# Altium schematic sheet SENSORS.SchDoc
size 393 x 261 mm; SheetNumber: 5; SheetTotal: 6
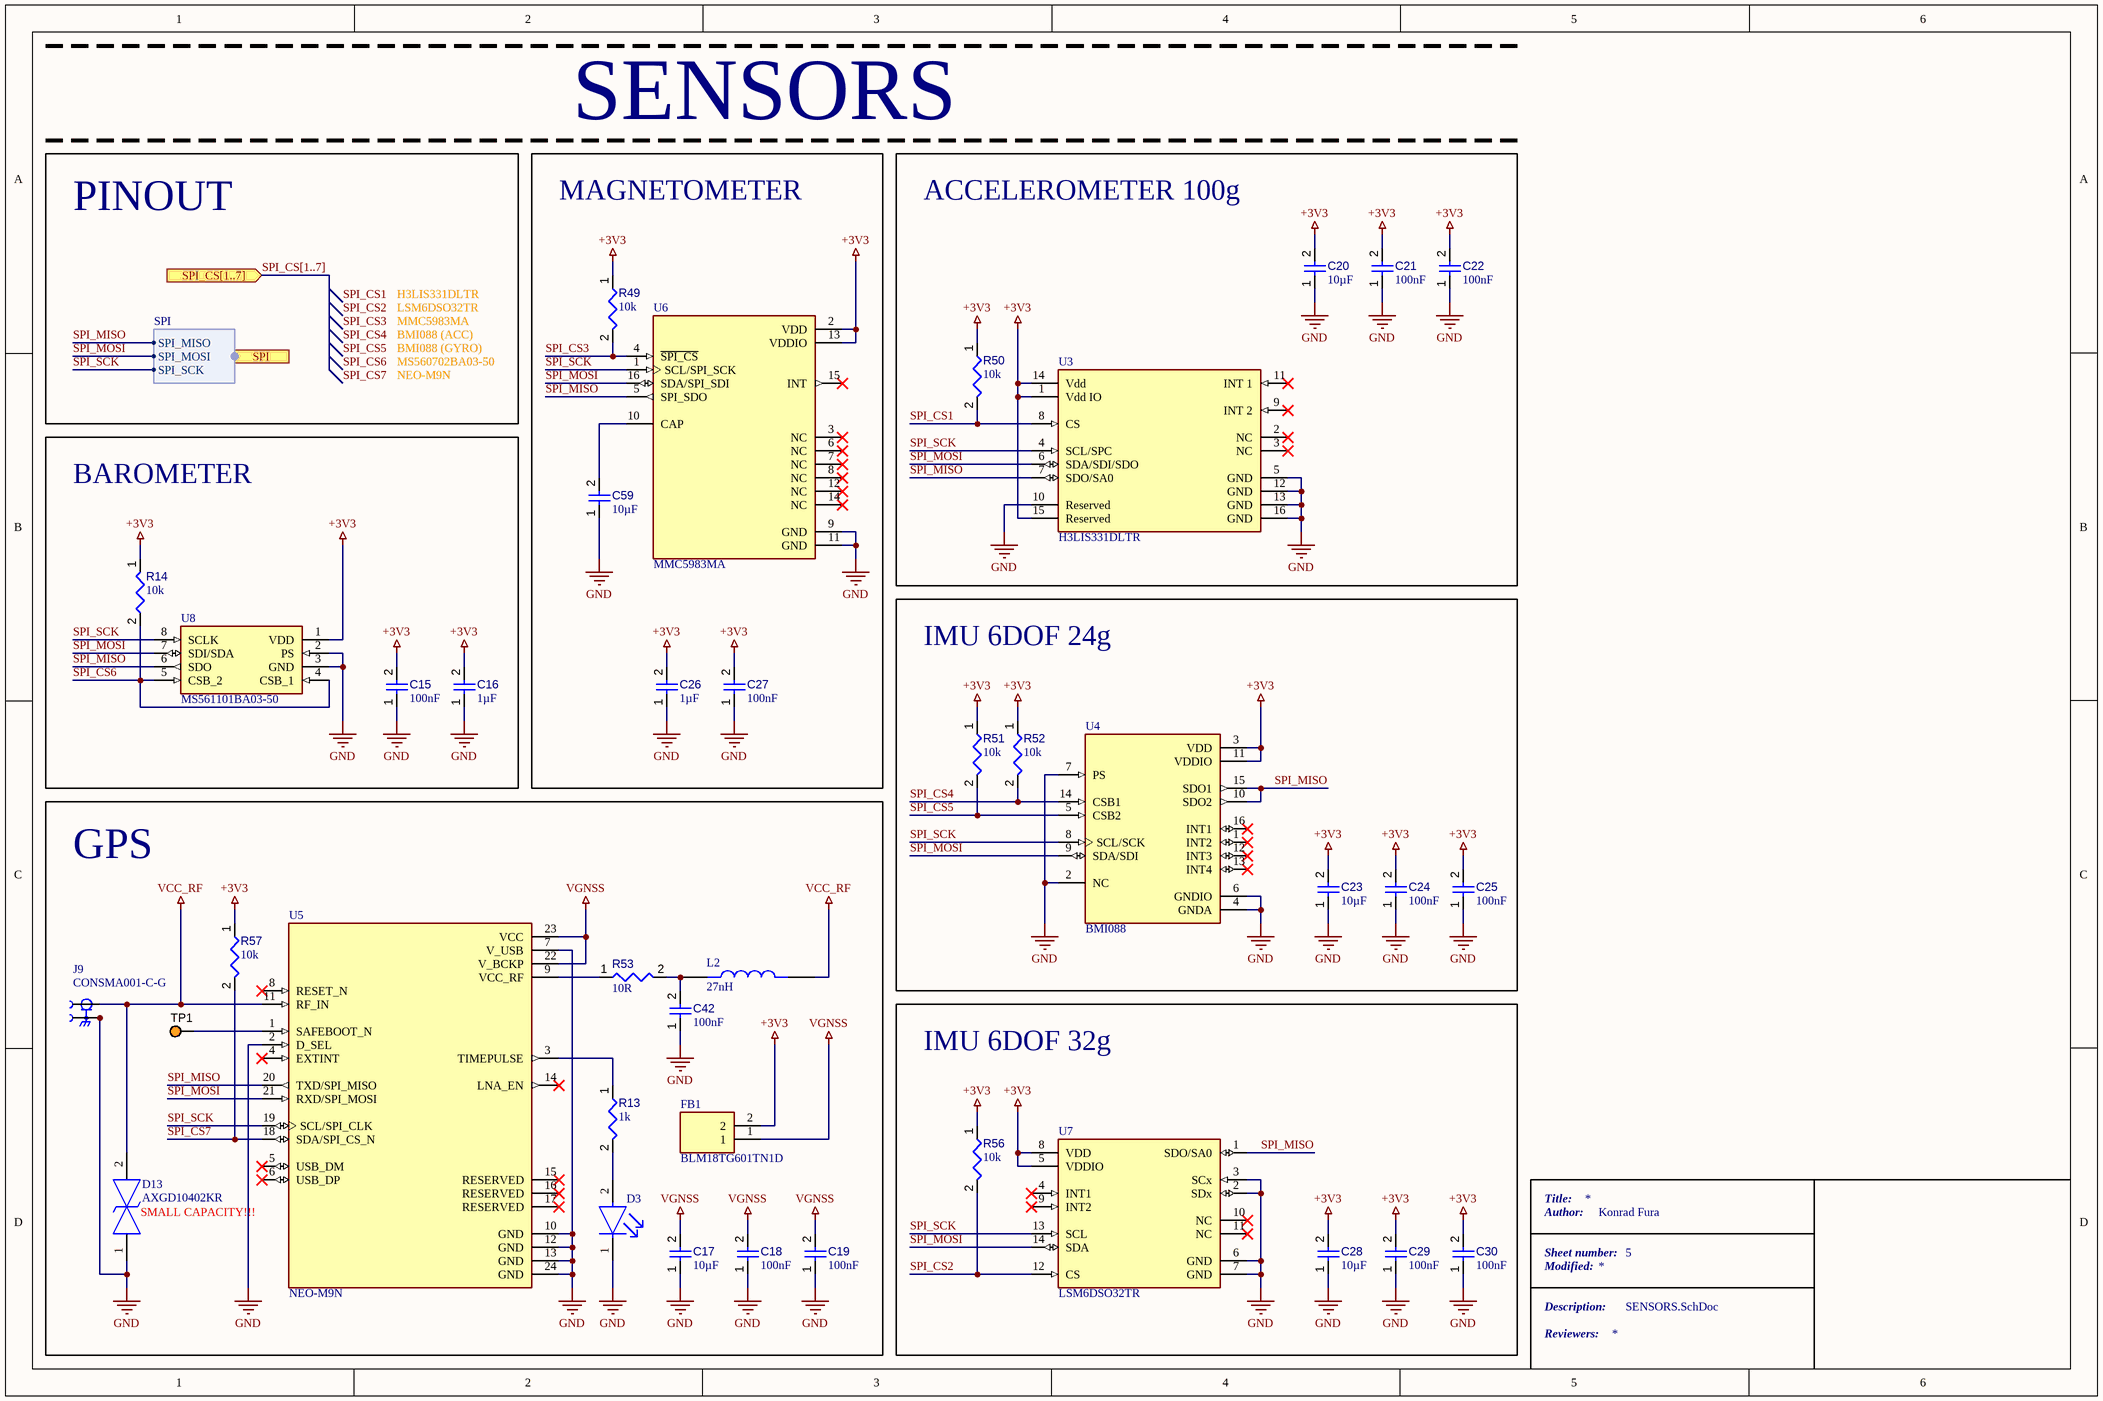
[diagram p0: SENSORS.SchDoc]

## Parts
C15  value 100nF  [CAPC0402(1005)60_L]  (hidden comment: Capacitor 100nF +/-20% 10V 0402)
C16  value 1µF  [CAPC0402(1005)60_L]  (hidden comment: Capacitor 1µF +/-20% 10V 0402)
C17  value 10µF  [CAPC0603(1608)100_L]  (hidden comment: Capacitor 10µF +/-20% 10V 0603)
C18  value 100nF  [CAPC0402(1005)60_L]  (hidden comment: Capacitor 100nF +/-20% 10V 0402)
C19  value 100nF  [CAPC0402(1005)60_L]  (hidden comment: Capacitor 100nF +/-20% 10V 0402)
C20  value 10µF  [CAPC0603(1608)100_L]  (hidden comment: Capacitor 10µF +/-20% 10V 0603)
C21  value 100nF  [CAPC0402(1005)60_L]  (hidden comment: Capacitor 100nF +/-20% 10V 0402)
C22  value 100nF  [CAPC0402(1005)60_L]  (hidden comment: Capacitor 100nF +/-20% 10V 0402)
C23  value 10µF  [CAPC0603(1608)100_L]  (hidden comment: Capacitor 10µF +/-20% 10V 0603)
C24  value 100nF  [CAPC0402(1005)60_L]  (hidden comment: Capacitor 100nF +/-20% 10V 0402)
C25  value 100nF  [CAPC0402(1005)60_L]  (hidden comment: Capacitor 100nF +/-20% 10V 0402)
C26  value 1µF  [CAPC0402(1005)60_L]  (hidden comment: Capacitor 1µF +/-20% 10V 0402)
C27  value 100nF  [CAPC0402(1005)60_L]  (hidden comment: Capacitor 100nF +/-20% 10V 0402)
C28  value 10µF  [CAPC0603(1608)100_L]  (hidden comment: Capacitor 10µF +/-20% 10V 0603)
C29  value 100nF  [CAPC0402(1005)60_L]  (hidden comment: Capacitor 100nF +/-20% 10V 0402)
C30  value 100nF  [CAPC0402(1005)60_L]  (hidden comment: Capacitor 100nF +/-20% 10V 0402)
C42  value 100nF  [CAPC0402(1005)60_L]  (hidden comment: Capacitor 100nF +/-20% 10V 0402)
C59  value 10µF  [CAPC0603(1608)100_L]  (hidden comment: Capacitor 10µF +/-20% 10V 0603)
D3  D3  [FP-LTST-C191TBKT-MFG]  (value not drawn)
D13  AXGD10402KR  [DIONM105X51N]
FB1  BLM18TG601TN1D  [BLM18EG101TH1D]
J9  CONSMA001-C-G  [LINX_CONSMA001-C-G]
L2  27nH  [INDC1005X65N]
R13  value 1k  [RESC0402(1005)_L]  (hidden comment: Resistor 1K +/-5 % 0402 63 mW)
R14  value 10k  [RESC0402(1005)_L]  (hidden comment: Resistor 10K  +/-1 % 0402 63 mW)
R49  value 10k  [RESC0402(1005)_L]  (hidden comment: Resistor 10K  +/-1 % 0402 63 mW)
R50  value 10k  [RESC0402(1005)_L]  (hidden comment: Resistor 10K  +/-1 % 0402 63 mW)
R51  value 10k  [RESC0402(1005)_L]  (hidden comment: Resistor 10K  +/-1 % 0402 63 mW)
R52  value 10k  [RESC0402(1005)_L]  (hidden comment: Resistor 10K  +/-1 % 0402 63 mW)
R53  value 10R  [RESC0402(1005)_L]  (hidden comment: Resistor 10R  +/-1 % 0402 63 mW)
R56  value 10k  [RESC0402(1005)_L]  (hidden comment: Resistor 10K  +/-1 % 0402 63 mW)
R57  value 10k  [RESC0402(1005)_L]  (hidden comment: Resistor 10K  +/-1 % 0402 63 mW)
TP1  5003  [KSTN-5003]  (value not drawn)
U3  H3LIS331DLTR  [FP-TFLGA16-7983231-MFG]
U4  BMI088  [PQFN50P450X300X100-16N]
U5  NEO-M9N  [XCVR_NEO-M9N]
U6  MMC5983MA  [PQFN50P300X300X100-16N]
U7  LSM6DSO32TR  [FP-LGA-14L-DM00249496-MFG]
U8  MS561101BA03-50  [MS561101BA03-50]

## Blocks framed on the sheet
SENSORS: C26 C27 C59 R49 U6
ACCELEROMETER 100g: C20-C22 R50 U3
BAROMETER: C15 C16 R14 U8
IMU 6DOF 24g: C23-C25 R51 R52 U4
GPS: C17-C19 C42 D3 D13 FB1 J9 L2 R13 R53 R57 TP1 U5
IMU 6DOF 32g: C28-C30 R56 U7

## Ports
SPI (harness SPI, see SYSTEM_OVERVIEW[4C], MCU[3A]), SPI_CS[1..7] (in, see SYSTEM_OVERVIEW[4C], MCU[6A])

## Harnesses
SPI: SPI_MISO, SPI_MOSI, SPI_SCK

## Nets
+3V3: C15.2 C16.2 C20.2 C21.2 C22.2 C23.2 C24.2 C25.2 C26.2 C27.2 C28.2 C29.2 C30.2 FB1.2 R14.1 R49.1 R50.1 R51.1 R52.1 R56.1 R57.1 U3.1(Vdd_IO) U3.14(Vdd) U3.15(Reserved) U4.3(VDD) U4.11(VDDIO) U6.2(VDD) U6.13(VDDIO) U7.5(VDDIO) U7.8(VDD) U8.1(VDD)
GND: C15.1 C16.1 C17.1 C18.1 C19.1 C20.1 C21.1 C22.1 C23.1 C24.1 C25.1 C26.1 C27.1 C28.1 C29.1 C30.1 C42.1 C59.1 D3.1(C) D13.1 J9.S1 J9.S2 J9.S3 J9.S4 U3.5(GND) U3.10(Reserved) U3.12(GND) U3.13(GND) U3.16(GND) U4.2(NC) U4.4(GNDA) U4.6(GNDIO) U4.7(PS) U5.2(D_SEL) U5.7(V_USB) U5.10(GND) U5.12(GND) U5.13(GND) U5.24(GND) U6.9(GND) U6.11(GND) U7.2(SDx) U7.3(SCx) U7.6(GND) U7.7(GND) U8.2(PS) U8.3(GND)
VCC_RF: D13.2 J9.1 L2.2 U5.11(RF_IN)
VGNSS: C17.2 C18.2 C19.2 FB1.1 U5.22(V_BCKP) U5.23(VCC)
SPI_CS1: R50.2 U3.8(CS)
SPI_CS2: R56.2 U7.12(CS)
SPI_CS3: R49.2 U6.4(~{SPI_CS})
SPI_CS4: R52.2 U4.14(CSB1)
SPI_CS5: R51.2 U4.5(CSB2)
SPI_CS6: R14.2 U8.4(CSB_1) U8.5(CSB_2)
SPI_CS7: R57.2 U5.18(SDA/SPI_CS_N)
SPI_MISO: U3.7(SDO/SA0) U4.10(SDO2) U4.15(SDO1) U5.20(TXD/SPI_MISO) U6.5(SPI_SDO) U7.1(SDO/SA0) U8.6(SDO) ; port SPI.SPI_MISO
SPI_MOSI: U3.6(SDA/SDI/SDO) U4.9(SDA/SDI) U5.21(RXD/SPI_MOSI) U6.16(SDA/SPI_SDI) U7.14(SDA) U8.7(SDI/SDA) ; port SPI.SPI_MOSI
SPI_SCK: U3.4(SCL/SPC) U4.8(SCL/SCK) U5.19(SCL/SPI_CLK) U6.1(SCL/SPI_SCK) U7.13(SCL) U8.8(SCLK) ; port SPI.SPI_SCK
NetC42_2: C42.2 L2.1 R53.2
NetC59_2: C59.2 U6.10(CAP)
NetD3_2: D3.2(A) R13.2
NetR13_1: R13.1 U5.3(TIMEPULSE)
NetR53_1: R53.1 U5.9(VCC_RF)
NetTP1_1: TP1.1 U5.1(SAFEBOOT_N)

Not connected (* = marked no-connect by the designer): U3 2(NC)* 3(NC)* 9(INT_2)* 11(INT_1)*; U4 1(INT2)* 12(INT3)* 13(INT4)* 16(INT1)*; U5 4(EXTINT)* 5(USB_DM)* 6(USB_DP)* 8(RESET_N)* 14(LNA_EN)* 15(RESERVED)* 16(RESERVED)* 17(RESERVED)*; U6 3(NC)* 6(NC)* 7(NC)* 8(NC)* 12(NC)* 14(NC)* 15(INT)*; U7 4(INT1)* 9(INT2)* 10(NC)* 11(NC)*

## Buses and harness runs
bus SPI_CS[1..7] = port SPI_CS[1..7]

## Notes on the sheet
- MAGNETOMETER
- PINOUT
- H3LIS331DLTR
- LSM6DSO32TR
- MMC5983MA
- BMI088 (ACC)
- BMI088 (GYRO)
- MS560702BA03-50
- NEO-M9N
- (near D13) SMALL CAPACITY!!!
- Title:
- Author:
- Konrad Fura
- Sheet number:
- Modified:
- Description:
- Reviewers:
- Labels drawn without touching a wire or pin: SPI_CS1, SPI_CS2, SPI_CS3, SPI_CS4, SPI_CS5, SPI_CS6, SPI_CS7

## Library data of the parts
C15 C18 C19 C21 C22 C24 C25 C27 C29 C30 C42 = CMP-001-00061-3: Chip Capacitor, 100nF +/-20%, 10V, 0402, Thickness 0.6 mm; Tolerance: 20%; Mounting Technology: SMT; Voltage Rating: 10V; Max Operating Temperature: 85°C; Pins: 2; Case/Package: 0402; Min Operating Temperature: -55°C
C16 C26 = CMP-001-00063-3: Chip Capacitor, 1µF +/-20%, 10V, 0402, Thickness 0.6 mm; Tolerance: 10%; Mounting Technology: SMT; Max Operating Temperature: 85°C; Voltage Rating: 10V; Pins: 2; Case/Package: 0402; Min Operating Temperature: -55°C
C17 C20 C23 C28 C59 = CMP-001-00075-4: Chip Capacitor, 10µF +/-20%, 10V, 0603, Thickness 1 mm; Tolerance: 10%; Voltage Rating: 10V; Max Operating Temperature: 85°C; Pins: 2; Case/Package: 0603; Mounting Technology: SMT; Min Operating Temperature: -55°C
D3 = CMP-22017-000008-1: LED BLUE CLEAR CHIP SMD; Lens Color: Colorless; Dominant Wavelength: 475nm; Forward Current: 20mA; Wavelength: 468nm; Viewing Angle: 130°; Power Dissipation: 76mW; Luminous Intensity: 180mcd; Reverse Voltage: 5V; Number of Elements: 1; Lens Style: Diffused; Forward Voltage: 3.8V; Max Power Dissipation: 75mW; Case Code (Metric): 1608; Packaging: Tape and Reel; Case/Package: 0603; Depth: 1.6mm; Mount: Surface Mount; Lead Free: Lead Free; Min Operating Temperature: -20°C; Lens Transparency: Clear; Illumination Color: Blue; Height: 0.55mm; Test Current: 20mA; Case Code (Imperial): 0603; Max Operating Temperature: 80°C; Number of Pins: 2; Length: 0.8mm; Radiation Hardening: No; Package Quantity: 1; Number of LEDs: 1; Width: 0.8mm; Color: Blue
D13 = AXGD10402KR: TVS Diode (Bi-directional); Manufacturer_Name: LITTELFUSE; Datasheet Link: https://www.littelfuse.com/~/media/electronics/datasheets/polymer_esd_suppressors/littelfuse_xtremeguard_axgd_datasheet.pdf.pdf; Height: 0.51mm; Manufacturer_Part_Number: AXGD10402KR; Mouser Part Number: 576-AXGD10402KR; Mouser Price/Stock: https://www.mouser.co.uk/ProductDetail/Littelfuse/AXGD10402KR?qs=%252BdQmOuGyFcFxx0p0UGW3NA%3D%3D; Arrow Part Number: AXGD10402KR; Arrow Price/Stock: https://www.arrow.com/en/products/axgd10402kr/littelfuse?region=nac
FB1 = BLM18TG601TN1D: Ferrite Bead; Manufacturer_Name: Murata Electronics; Datasheet Link: http://www.murata.com/~/media/webrenewal/support/library/catalog/products/emc/emifil/c31e.ashx?la=en-gb; Height: 0.75mm; Manufacturer_Part_Number: BLM18TG601TN1D; Mouser Part Number: 81-BLM18TG601TN1D; Mouser Price/Stock: https://www.mouser.co.uk/ProductDetail/Murata-Electronics/BLM18TG601TN1D/?qs=%2F%252BYoplLUB5j4EvNKGf%252BxGQ%3D%3D; Arrow Part Number: BLM18TG601TN1D; Arrow Price/Stock: https://www.arrow.com/en/products/blm18tg601tn1d/murata-manufacturing?region=nac
J9 = CONSMA001-C-G: <a href="https://pricing.snapeda.com/parts/CONSMA001-C-G/Linx%20Technologies/view-part?ref=eda">Check availability</a> <a href="https://pricing.snapeda.com/parts/CONSMA001-C-G/Linx%20Technologies/view-part?ref=eda">Check availability</a>; MF: {'manufacturer': u'Linx Technologies'}; Package: None; Price: None; Value: *; MP: CONSMA001-C-G; Availability: Unavailable
L2 = AIMC-0402-27NJ-T: IND 27nH 0.3A 1000mâ„¦; MF: {'manufacturer': u'Abracon'}; Package: None; Price: None; Value: *; MP: AIMC-0402-27NJ-T; Availability: Unavailable
R13 = CMP-009-00157-3: Chip Resistor, 1 kOhms, +/-5 %, 63 mW, -55 to 155 degC, 0402; Tolerance: 5%; Power: 63mW; Case/Package: 0402; Pins: 2; Min Operating Temperature: -55°C; Max Operating Temperature: 155°C
R14 R49-R52 R56 R57 = CMP-009-00149-3: Chip Resistor, 10 kOhms, +/-1 %, 63 mW, -55 to 125 degC, 0402; Power: 63mW; Tolerance: 1%; Min Operating Temperature: -55°C; Case/Package: 0402; Max Operating Temperature: 155°C; Pins: 2
R53 = CMP-009-00152-3: Chip Resistor, 10 Ohms, +/-1 %, 63 mW, -55 to 155 degC, 0402; Tolerance: 1%; Power: 63mW; Pins: 2; Max Operating Temperature: 155°C; Min Operating Temperature: -55°C; Case/Package: 0402
TP1 = CMP-002-00037-2: Test Point, Orange, Height 4.6 mm, Tail Length 3 mm, 1-Pin THD, RoHS; Manufacturer: Keystone; Colour: Orange; Packaging: Bulk; Package Description: 1-Pin Through Hole Device, Dia 2.54 mm; Pins: 1; Package Reference: 5003; Datasheet Version: Jun-15; Case/Package: 5003; Mounting Technology: TH; Connector Type: TestPoint; Diameter: 2.54mm; Contact Material: Bronze; Datasheet URL: http://keyelco.com/userAssets/file/M65p56.pdf; Manufacturer URL: http://www.keyelco.com/; Package Quantity: 10; Contact Plating: Tin; RoHS Compliant: True
U3 = CMP-12175-000002-1: ACCEL 100-400G I2C/SPI 16TFLGA; Manufacturer: STMicroelectronics; Min Supply Voltage: 2.16V; Accel Axis: X+Y and Z; Sensor Output: I2C,SPI; Accel Resolution: 16bits; Operating Supply Current: 10-300uA; Accel Range: 100/200/400g; Max Supply Voltage: 3.6V; Temperature: -40°C to +85°C; Octopart: https://octopart.com/h3lis331dltr-stmicroelectronics-29186499; Automotive: No; Digikey Description: ACCEL 100-400G I2C/SPI 16TFLGA; Device Class L3: Accelerometers; ComponentLink2URL: https://www.st.com/resource/en/datasheet/h3lis331dl.pdf; Device Class L2: Motion Sensors; Package: TFLGA16-7983231; Mouser Description: Accelerometer Triple +/-100g/+/-200g/+/-400g 2.5V 16-Pin TFLGA T/R; ComponentLink2Description: Datasheet; Device Class L1: Sensors; Lead Free: Yes; RoHS: TRUE; Footprint Url: https://www.st.com/content/ccc/resource/technical/document/technical_note/73/17/9c/16/dd/96/4a/01/CD00134799.pdf/files/CD00134799.pdf/jcr:content/translations/en.CD00134799.pdf; Height: 1mm; Category: IC; Manufacturer Part Number: H3LIS331DLTR; Temperature Range Low: -40°C; Temperature Range High: +85°C
U4 = BMI088: High-performance 6-axis inertial sensor (accelerometer + gyroscope) <a href="https://pricing.snapeda.com/parts/BMI088/Bosch%20Sensortec/view-part?ref=eda">Check prices</a>; MF: {'manufacturer': u'Bosch Sensortec'}; Availability: Unavailable; Value: *; Package: None; Price: None; MP: BMI088
U5 = NEO-M9N: MF: {'manufacturer': u'U-Blox'}; Package: None; Price: None; Value: *; MP: NEO-M9N; Availability: Unavailable
U6 = MMC5983MA: MMC5983 series Magnetic, Magnetometer Sensor Evaluation Board; MF: {'manufacturer': u'Memsic Inc.'}; Availability: Unavailable; Package: None; MP: MMC5983MA; Value: *; Price: None
U7 = CMP-12177-000015-1: INEMO INERTIAL MODULE: 3D ACCELE
U8 = MS561101BA03-50: Integrated Circuit; Manufacturer_Name: TE Connectivity; Datasheet Link: https://www.te.com/commerce/DocumentDelivery/DDEController?Action=srchrtrv&DocNm=MS5611-01BA03&DocType=Data%20Sheet&DocLang=English&PartCntxt=MS561101BA03-50&DocFormat=pdf; Manufacturer_Part_Number: MS561101BA03-50; Mouser Part Number: 824-MS561101BA03-50; Mouser Price/Stock: https://www.mouser.co.uk/ProductDetail/Measurement-Specialties/MS561101BA03-50?qs=%252BgKeJhng5iV%252BnCz6Qd5iDw%3D%3D; Arrow Part Number: MS561101BA03-50; Arrow Price/Stock: https://www.arrow.com/en/products/ms561101ba03-50/te-connectivity?region=nac